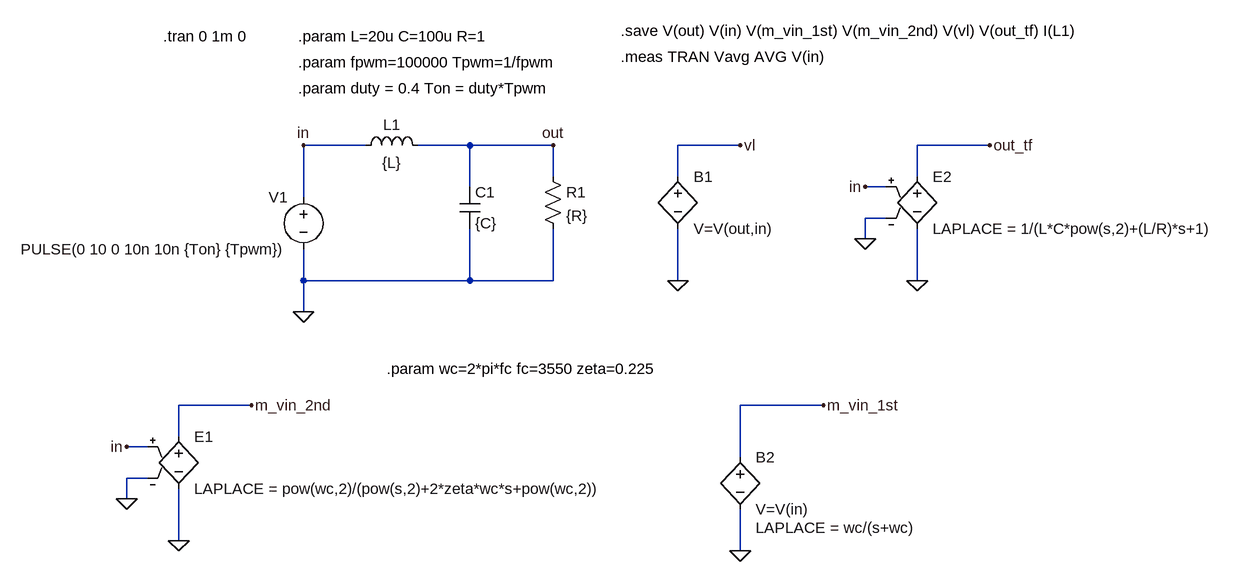
[diagram p0: schematic behavioral_buck.asc]
behavioral_buck.asc, the LTspice schematic file:
Version 4.1
SHEET 1 1652 1012
WIRE 208 32 112 32
WIRE 368 32 288 32
WIRE 496 32 368 32
WIRE 784 32 688 32
WIRE 1168 32 1056 32
WIRE 496 80 496 32
WIRE 688 80 688 32
WIRE 1056 80 1056 32
WIRE 368 96 368 32
WIRE 1008 96 976 96
WIRE 112 112 112 32
WIRE 1008 144 976 144
WIRE 976 176 976 144
WIRE 112 240 112 192
WIRE 368 240 368 160
WIRE 368 240 112 240
WIRE 496 240 496 160
WIRE 496 240 368 240
WIRE 688 240 688 160
WIRE 1056 240 1056 160
WIRE 112 288 112 240
WIRE 32 432 -80 432
WIRE 912 432 784 432
WIRE -80 480 -80 432
WIRE -128 496 -160 496
WIRE 784 512 784 432
WIRE -128 544 -160 544
WIRE -160 576 -160 544
WIRE -80 640 -80 560
WIRE 784 656 784 592
FLAG 112 288 0
FLAG 496 32 out
FLAG 112 32 in
FLAG 688 240 0
FLAG 784 32 vl
FLAG -80 640 0
FLAG 32 432 m_vin_2nd
FLAG -160 576 0
FLAG -160 496 in
FLAG 784 656 0
FLAG 912 432 m_vin_1st
FLAG 1056 240 0
FLAG 1168 32 out_tf
FLAG 976 176 0
FLAG 976 96 in
SYMBOL voltage 112 96 M0
WINDOW 123 0 0 Left 0
WINDOW 39 0 0 Left 0
SYMATTR InstName V1
SYMATTR Value PULSE(0 10 0 10n 10n {Ton} {Tpwm})
SYMBOL ind 192 48 R270
WINDOW 0 32 56 VTop 2
WINDOW 3 5 56 VBottom 2
SYMATTR InstName L1
SYMATTR Value {L}
SYMATTR SpiceLine Rser=1m
SYMBOL cap 352 96 R0
SYMATTR InstName C1
SYMATTR Value {C}
SYMBOL res 480 64 R0
SYMATTR InstName R1
SYMATTR Value {R}
SYMBOL bv 688 64 R0
SYMATTR InstName B1
SYMATTR Value V=V(out,in)
SYMBOL e -80 464 R0
SYMATTR InstName E1
SYMATTR Value LAPLACE = pow(wc,2)/(pow(s,2)+2*zeta*wc*s+pow(wc,2))
SYMBOL bv 784 496 R0
WINDOW 123 24 124 Left 2
SYMATTR Value2 LAPLACE = wc/(s+wc)
SYMATTR InstName B2
SYMATTR Value V=V(in)
SYMBOL e 1056 64 R0
SYMATTR InstName E2
SYMATTR Value LAPLACE = 1/(L*C*pow(s,2)+(L/R)*s+1)
TEXT -104 -136 Left 2 !.tran 0 1m 0
TEXT 104 -136 Left 2 !.param L=20u C=100u R=1
TEXT 104 -96 Left 2 !.param fpwm=100000 Tpwm=1/fpwm
TEXT 104 -56 Left 2 !.param duty = 0.4 Ton = duty*Tpwm
TEXT 240 376 Left 2 !.param wc=2*pi*fc fc=3550 zeta=0.225
TEXT 600 -104 Left 2 !.meas TRAN Vavg AVG V(in)
TEXT 600 -144 Left 2 !.save V(out) V(in) V(m_vin_1st) V(m_vin_2nd) V(vl) V(out_tf) I(L1)

The netlist it stands for:
* behavioral_buck.asc
V1 in 0 PULSE(0 10 0 10n 10n {Ton} {Tpwm})
L1 in out {L} Rser=1m
C1 out 0 {C}
R1 out 0 {R}
B1 vl 0 V=V(out,in)
E1 m_vin_2nd 0 in 0 LAPLACE = pow(wc,2)/(pow(s,2)+2*zeta*wc*s+pow(wc,2))
B2 m_vin_1st 0 V=V(in) LAPLACE = wc/(s+wc)
E2 out_tf 0 in 0 LAPLACE = 1/(L*C*pow(s,2)+(L/R)*s+1)
.tran 0 1m 0
.param L=20u C=100u R=1
.param fpwm=100000 Tpwm=1/fpwm
.param duty = 0.4 Ton = duty*Tpwm
.param wc=2*pi*fc fc=3550 zeta=0.225
.meas TRAN Vavg AVG V(in)
.save V(out) V(in) V(m_vin_1st) V(m_vin_2nd) V(vl) V(out_tf) I(L1)
.backanno
.end